# EAGLE design tiny fox predatronics (EAGLE 9.5.2)
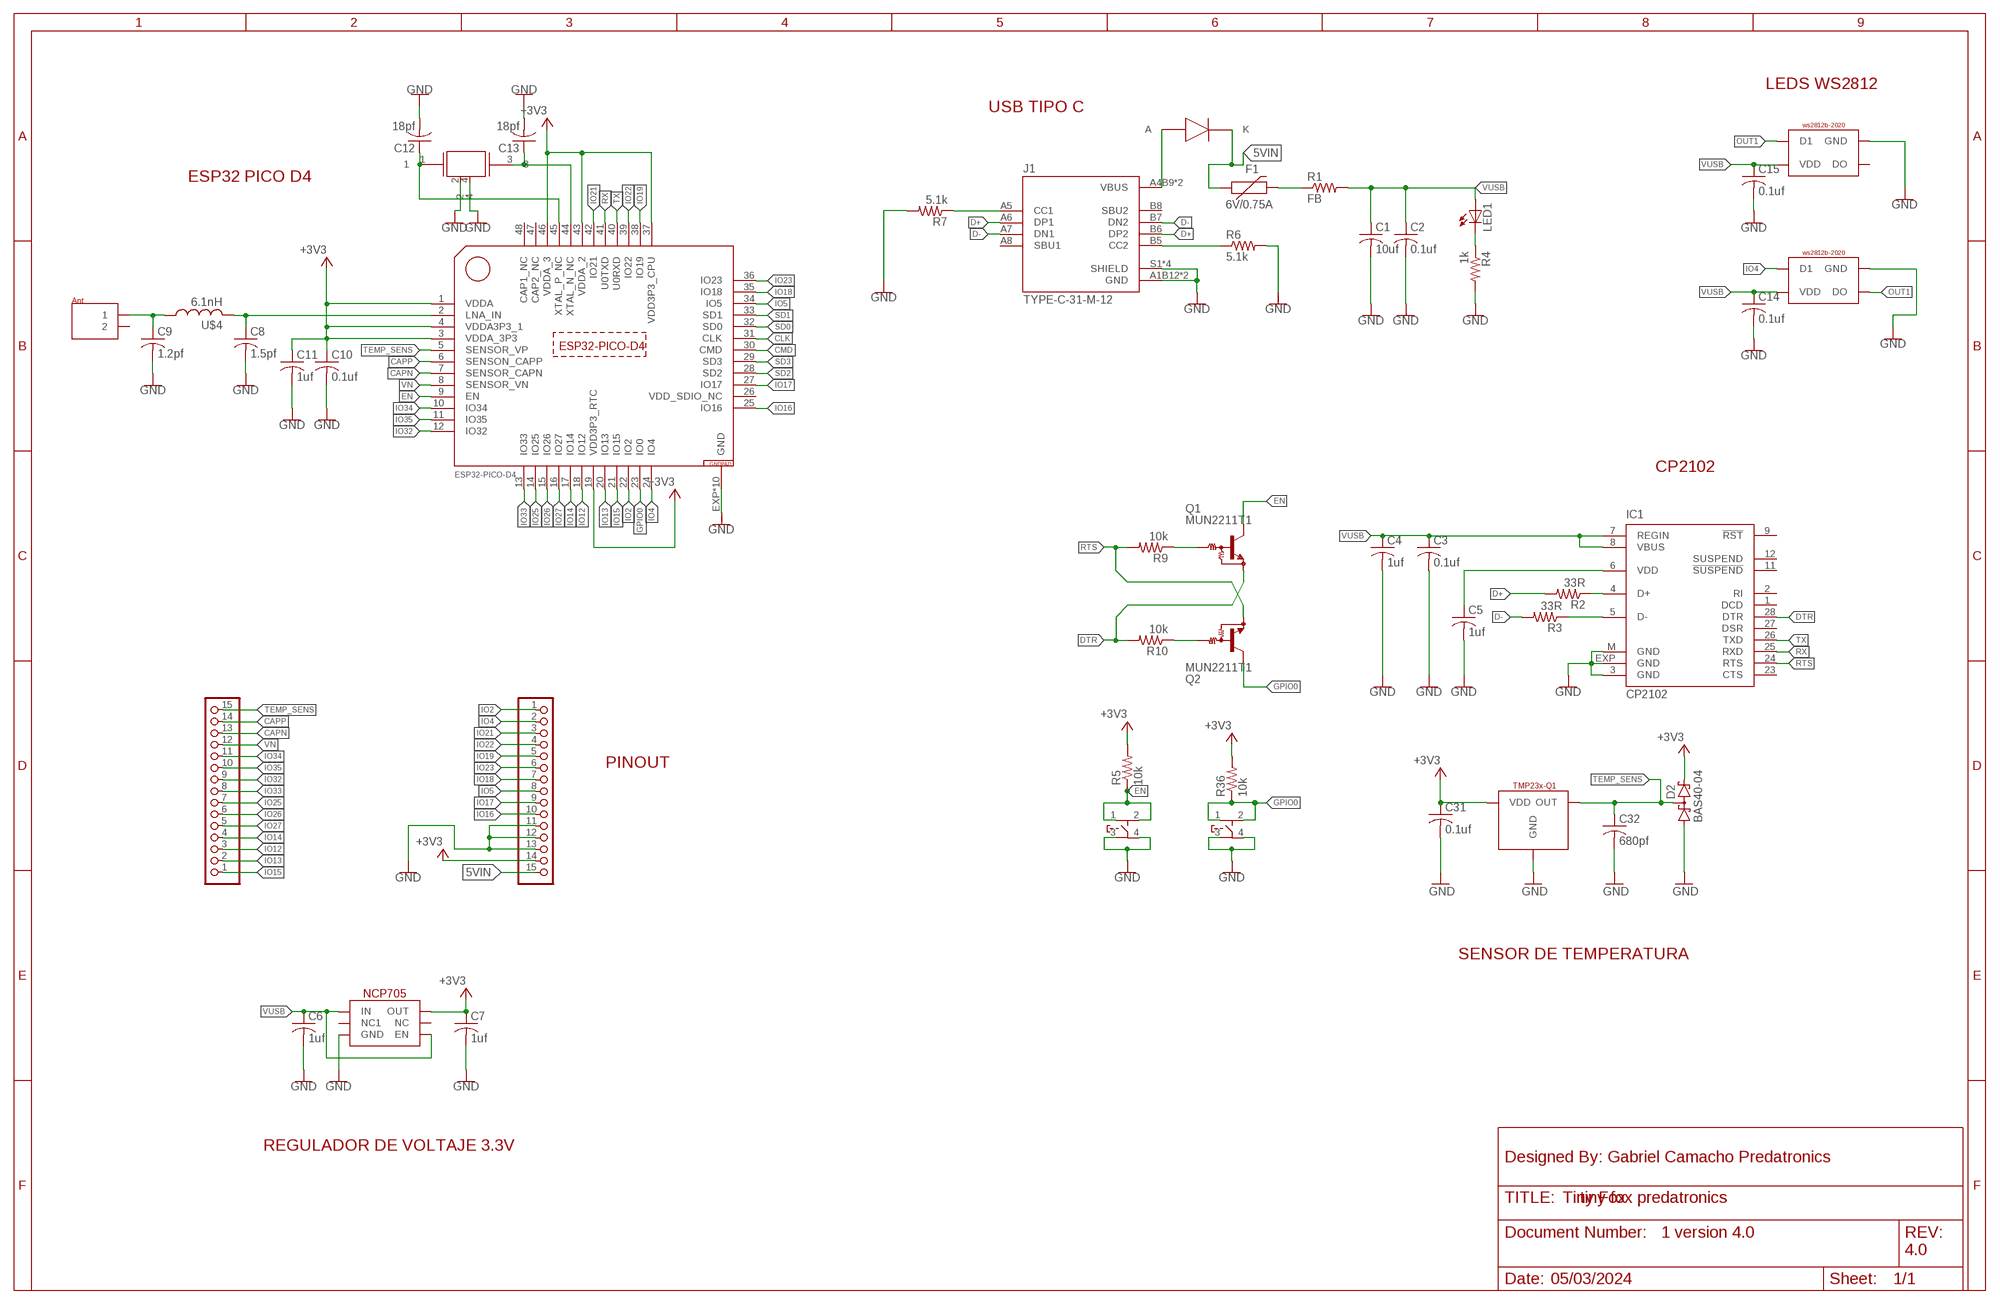
[diagram p0: schematic, sheet 1]

## Parts
C1  10uf  C-USC0805  [C0805]
C2  0.1uf  C-USC0603  [C0603]
C3  0.1uf  C-USC0603  [C0603]
C4  1uf  C-USC0603  [C0603]
C5  1uf  C-USC0603  [C0603]
C6  1uf  C-USC0603  [C0603]
C7  1uf  C-USC0603  [C0603]
C8  1.5pf  C-USC0402  [C0402]
C9  1.2pf  C-USC0402  [C0402]
C10  0.1uf  C-USC0603  [C0603]
C11  1uf  C-USC0603  [C0603]
C12  18pf  C-USC0603  [C0603]
C13  18pf  C-USC0603  [C0603]
C14  0.1uf  C-USC0603  [C0603]
C15  0.1uf  C-USC0603  [C0603]
C31  0.1uf  C-USC0603  [C0603]
C32  680pf  C-USC0603  [C0603]
D2  BAS40-04  [SOT23]
F1  6V/0.75A  PPTC_THREE-QUARTER-AMP  [1206]
IC1  CP2102  [MLP28]
J1  TYPE-C-31-M-12  [HRO_TYPE-C-31-M-12]
JP1  PINHD-1X15  [1X15]
JP2  PINHD-1X15  [1X15]
LED1  LEDCHIPLED_0603  [CHIPLED_0603]
Q1  MUN2211T1  [SC59-BEC]
Q2  MUN2211T1  [SC59-BEC]
R1  FB  R-US_R0805  [R0805]
R2  33R  R-US_R0603  [R0603]
R3  33R  R-US_R0603  [R0603]
R4  1k  R-US_R0603  [R0603]
R5  10k  R-US_R0603  [R0603]
R6  5.1k  R-US_R0402  [R0402]
R7  5.1k  R-US_R0402  [R0402]
R9  10k  R-US_R0603  [R0603]
R10  10k  R-US_R0603  [R0603]
R36  10k  R-US_R0603  [R0603]
U$1  ESP32-PICO-D4  [QFN48]
U$2  WS2812B-2020  [2020]
U$3  NCP705  [WDFN6]
U$4  6.1nH  INDUCTOR_0402_M  [RESC0402_M]
U$5  CHIP-ANTHENA  [ANTHENFOOT]
U$6  ECX-32  [EXC-32]
U$7  WS2812B-2020  [2020]
U$10  RB160MM-50TF  [SOD-123FL]
U$21  TMP23X-Q1  [SOT-23]
U$22  XUNPU  [TS-1089S]
U$23  XUNPU  [TS-1089S]

## Nets
5VIN: F1.1 JP2.15 U$10.K
+3V3: C7.1 C10.1 C11.1 C31.1 D2.2(C2) JP2.14 R5.2 R36.2 U$1.1(VDDA) U$1.3(VDDA_3P3) U$1.4(VDDA3P3_1) U$1.19(VDD3P3_RTC) U$1.37(VDD3P3_CPU) U$1.43(VDDA_2) U$1.46(VDDA_3) U$3.OUT U$21.VDD
CAPN: JP1.13 U$1.7(SENSOR_CAPN)
CAPP: JP1.14 U$1.6(SENSON_CAPP)
CLK: U$1.31(CLK)
CMD: U$1.30(CMD)
D+: J1.A6(DP1) J1.B6(DP2) R2.2
D-: J1.A7(DN1) J1.B7(DN2) R3.2
DTR: IC1.28(DTR) Q1.E R10.2
EN: Q1.C R5.1 U$1.9(EN) U$22.1 U$22.2
GND: C1.2 C2.2 C3.2 C4.2 C5.2 C6.2 C7.2 C8.2 C9.2 C10.2 C11.2 C12.2 C13.2 C14.2 C15.2 C31.2 C32.2 D2.1(A1) IC1.3(GND) IC1.EXP(GND) IC1.M(GND) J1.A1B12(GND) J1.B1A12(GND) J1.S1(SHIELD) J1.S2(SHIELD) J1.S3(SHIELD) J1.S4(SHIELD) JP2.11 JP2.12 JP2.13 R4.2 R6.2 R7.2 U$1.EXP(GND) U$1.P$1(GND) U$1.P$2(GND) U$1.P$3(GND) U$1.P$4(GND) U$1.P$5(GND) U$1.P$6(GND) U$1.P$7(GND) U$1.P$8(GND) U$1.P$9(GND) U$2.GND U$3.GND U$3.P$7(GND) U$3.P$8(GND) U$6.2 U$6.4 U$7.GND U$21.GND U$22.3 U$22.4 U$23.3 U$23.4
GPIO0: Q2.C R36.1 U$1.23(IO0) U$23.1 U$23.2
IO2: JP2.1 U$1.22(IO2)
IO4: JP2.2 U$1.24(IO4) U$2.D1
IO5: JP2.8 U$1.34(IO5)
IO12: JP1.3 U$1.18(IO12)
IO13: JP1.2 U$1.20(IO13)
IO14: JP1.4 U$1.17(IO14)
IO15: JP1.1 U$1.21(IO15)
IO16: JP2.10 U$1.25(IO16)
IO17: JP2.9 U$1.27(IO17)
IO18: JP2.7 U$1.35(IO18)
IO19: JP2.5 U$1.38(IO19)
IO21: JP2.3 U$1.42(IO21)
IO22: JP2.4 U$1.39(IO22)
IO23: JP2.6 U$1.36(IO23)
IO25: JP1.7 U$1.14(IO25)
IO26: JP1.6 U$1.15(IO26)
IO27: JP1.5 U$1.16(IO27)
IO32: JP1.9 U$1.12(IO32)
IO33: JP1.8 U$1.13(IO33)
IO34: JP1.11 U$1.10(IO34)
IO35: JP1.10 U$1.11(IO35)
N$1: J1.A4B9(VBUS) J1.B4A9(VBUS) U$10.A
N$2: J1.B5(CC2) R6.1
N$3: IC1.4(D+) R2.1
N$4: IC1.5(D-) R3.1
N$5: C5.1 IC1.6(VDD)
N$6: LED1.C R4.1
N$7: C9.1 U$4.1 U$5.1
N$8: C8.1 U$1.2(LNA_IN) U$4.2
N$9: C13.1 U$1.44(XTAL_N_NC) U$6.3
N$10: Q1.B R9.1
N$11: Q2.B R10.1
N$12: C12.1 U$1.45(XTAL_P_NC) U$6.1
N$13: J1.A5(CC1) R7.1
N$14: F1.2 R1.1
OUT1: U$2.DO U$7.D1
RTS: IC1.24(RTS) Q2.E R9.2
RX: IC1.25(RXD) U$1.41(U0TXD)
SD0: U$1.32(SD0)
SD1: U$1.33(SD1)
SD2: U$1.28(SD2)
SD3: U$1.29(SD3)
TEMP_SENS: C32.1 D2.3(C1A2) JP1.15 U$1.5(SENSOR_VP) U$21.VOUT(OUT)
TX: IC1.26(TXD) U$1.40(U0RXD)
VN: JP1.12 U$1.8(SENSOR_VN)
VUSB: C1.1 C2.1 C3.1 C4.1 C6.1 C14.1 C15.1 IC1.7(REGIN) IC1.8(VBUS) LED1.A R1.2 U$2.VDD U$3.EN U$3.IN U$7.VDD
Unconnected: IC1.1(DCD) IC1.2(RI) IC1.9(!RST) IC1.11(!SUSPEND) IC1.12(SUSPEND) IC1.23(CTS) IC1.27(DSR) J1.A8(SBU1) J1.B8(SBU2) U$1.47(CAP2_NC) U$1.48(CAP1_NC) U$3.NC U$3.NC1 U$5.2 U$7.DO

## Notes on the sheet
- LEDS WS2812
- USB TIPO C
- ESP32 PICO D4
- CP2102
- PINOUT
- SENSOR DE TEMPERATURA
- REGULADOR DE VOLTAJE 3.3V
- Designed By: Gabriel Camacho Predatronics
- Tiny Fox
- 1 version 4.0
- 4.0
- 05/03/2024

## Power pins joined to a net without a drawn wire
VDD_SDIO_NC: U$1.26(VDD_SDIO_NC)

## Library data of the parts
C1-C15 C31 C32 = rcl:C-US: CAPACITOR, American symbol; SPICEPREFIX: C
D2 = diode:BAS40-04: Silicon Schottky Diodes General-purpose diode for high-speed switching
F1 = SparkFun-Fuses:PPTC: Resettable Fuse PPTC Resettable Fuse. Really a sort of resistor with a polymeric positive temperature coefficient whose resistance increases dramatically with an increase in temperature. When heated by the power passing through the resistance rises causing the current to be limited, protecting the circuit. This is achieved by the transition of the polymer from a crystalline to an amorphous state where the conductive carbon separates breaking the conductive pathways found in the cool crystalline structure. When a PPTC cools back down it resumes conducting letting the circuit turn back on. SparkFun Products: SparkFun RedBoard - Programmed with Arduino <https://www.sparkfun.com/products/12757> Pro Micro - 5V/16MHz <https://www.sparkfun.com/products/12640> Arduino Pro 328 - 5V/16MHz <https://www.sparkfun.com/products/10915> MP3 Trigger <https://www.sparkfun.com/products/13720>; PROD_ID: RES-11150
IC1 = silabs:CP210*: Single-Chip USB to UART Bridge Source: www.silabs.com .. CP2101.pdf / cp2102.pdf; MF: FARNELL; MPN: CP2102-GM; OC_FARNELL: 9282130; OC_NEWARK: 30K5635
J1 = TYPE-C-31-M-12:TYPE-C-31-M-12: USB Connectors 24 Receptacle 1 8.94*7.3mm RoHS Check availability <https://pricing.snapeda.com/parts/TYPE-C-31-M-12/HRO%20Electronics%20Co.%2C%20Ltd./view-part?ref=eda>; AVAILABILITY: Not in stock; DESCRIPTION: USB Connectors 24 Receptacle 1 8.94*7.3mm RoHS; MF: HRO Electronics Co., Ltd.; MP: TYPE-C-31-M-12; PACKAGE: Package; PRICE: None
JP1 JP2 = pinhead:PINHD-1X15: PIN HEADER
LED1 = adafruit:LED: LED OSRAM: - CHIPLED LG R971, LG N971, LY N971, LG Q971, LY Q971, LO R971, LY R971 LH N974, LH R974 LS Q976, LO Q976, LY Q976 LO Q996 - Hyper CHIPLED LW Q18S LB Q993, LB Q99A, LB R99A - SideLED LS A670, LO A670, LY A670, LG A670, LP A670 LB A673, LV A673, LT A673, LW A673 LH A674 LY A675 LS A676, LA A676, LO A676, LY A676, LW A676 LS A679, LY A679, LG A679 - Hyper Micro SIDELED® LS Y876, LA Y876, LO Y876, LY Y876 LT Y87S - SmartLED LW L88C, LW L88S LB L89C, LB L89S, LG L890 LS L89K, LO L89K, LY L89K LS L896, LA L896, LO L896, LY L896 - TOPLED LS T670, LO T670, LY T670, LG T670, LP T670 LSG T670, LSP T670, LSY T670, LOP T670, LYG T670 LG T671, LOG T671, LSG T671 LB T673, LV T673, LT T673, LW T673 LH T674 LS T676, LA T676, LO T676, LY T676, LB T676, LH T676, LSB T676, LW T676 LB T67C, LV T67C, LT T67C, LS T67K, LO T67K, LY T67K, LW E67C LS E67B, LA E67B, LO E67B, LY E67B, LB E67C, LV E67C, LT E67C LW T67C LS T679, LY T679, LG T679 LS T770, LO T770, LY T770, LG T770, LP T770 LB T773, LV T773, LT T773, LW T773 LH T774 LS E675, LA E675, LY E675, LS T675 LS T776, LA T776, LO T776, LY T776, LB T776 LHGB T686 LT T68C, LB T68C - Hyper Mini TOPLED® LB M676 - Mini TOPLED Santana® LG M470 LS M47K, LO M47K, LY M47K Source: http://www.osram.convergy.de/
Q1 Q2 = transistor-npn:MUN2211*: NPN Bias Resistor Transistor
R1 = audio amplifier example:R-US_: RESISTOR, American symbol
R2-R4 R9 R10 = resistor:R-US_: RESISTOR, American symbol
R5 R36 = adafruit:R-US_: RESISTOR, American symbol
R6 R7 = rcl:R-US_: RESISTOR, American symbol; SPICEPREFIX: R
U$1 = esp32-pico-d4:ESP32-PICO-D4
U$2 U$7 = ws2812b-2020:WS2812B-2020
U$3 = NCP705:NCP705
U$4 = Nordic_nRF:INDUCTOR: Generic chip inductor
U$5 = NN01-110:CHIP-ANTHENA
U$6 = cristal:ECX-32
U$10 = RB160MM-50TF:RB160MM-50TF
U$21 = TMP23x-Q1:TMP23X-Q1
U$22 U$23 = TS-1089S-02526:XUNPU

## Board
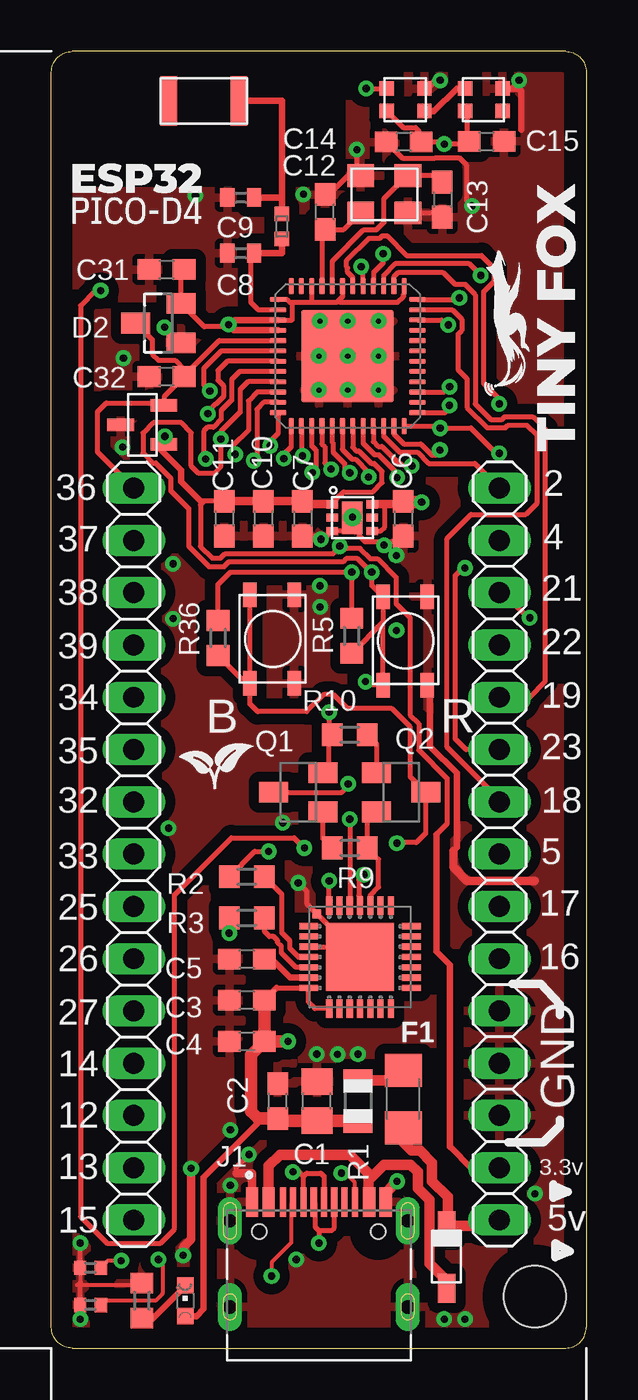
[diagram p1: board, top side]
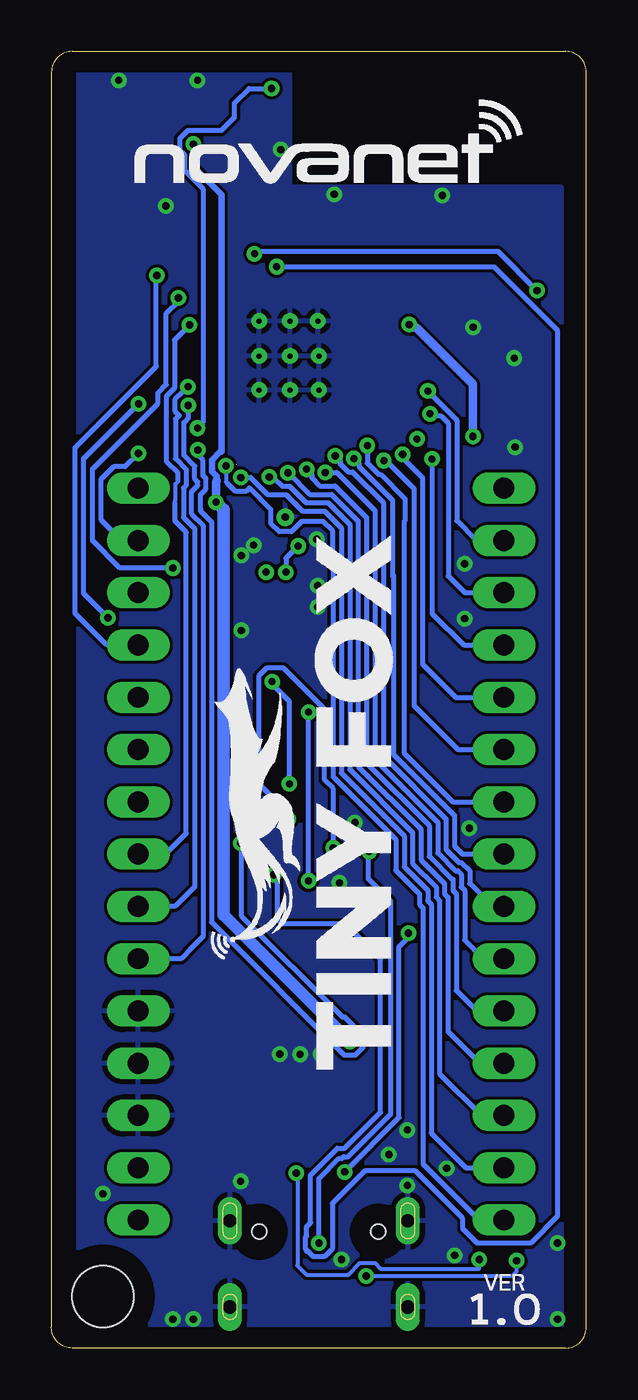
[diagram p2: board, bottom side, seen from below]

Size 26 x 63 mm. Coordinates in mm from the lower left corner, seen from the top.
Outline: 1,0 25,0 arc90 26,1 26,62 arc90 25,63 1,63 arc90 0,62 0,1 arc90 1,0
Copper layers (1*16): Top 0.035mm / dielectric 1.5mm / Bottom 0.035mm
Design rules "default *": minimum track width 6mil, minimum drill 0.35mm, track to track 6mil, track to pad 6mil, pad to pad 6mil, via to via 6mil, smd to smd 6mil, copper to edge 40mil, drill to drill 6mil, minimum pad ring 10mil, minimum via ring 8mil, stop-mask expansion 4mil, vias tented up to drill 14mil, thermal gap 10mil
Holes 3 mm at 23.5,2.5

### Footprints (pad centres in the part's own frame; a part is rotated, then mirrored left to right if it is on the bottom)
C0805 = smd 1.3 x 1.5: 1 -0.95,0; 2 0.95,0
C0603 = smd 1.1 x 1: 1 -0.85,0; 2 0.85,0
C0402 = smd 0.7 x 0.9: 1 -0.65,0; 2 0.65,0
SOT23 = smd 1 x 1.4: 1 -0.95,-1.1; 2 0.95,-1.1; 3 0,1.1
1206 = smd 1.6 x 1.8: 1 -1.4,0; 2 1.4,0
MLP28 = smd 0.9 x 0.3: 1 -2.5,1.5; 2 -2.5,1; 3 -2.5,0.5; 4 -2.5,0; 5 -2.5,-0.5; 6 -2.5,-1; 7 -2.5,-1.5; 15 2.5,-1.5; 16 2.5,-1; 17 2.5,-0.5; 18 2.5,0; 19 2.5,0.5; 20 2.5,1; 21 2.5,1.5 | smd 0.3 x 0.9: 8 -1.5,-2.5; 9 -1,-2.5; 10 -0.5,-2.5; 11 0,-2.5; 12 0.5,-2.5; 13 1,-2.5; 14 1.5,-2.5; 22 1.5,2.5; 23 1,2.5; 24 0.5,2.5; 25 0,2.5; 26 -0.5,2.5; 27 -1,2.5; 28 -1.5,2.5 | smd 3.3 x 3.3: EXP 0,0 | smd 0.435 x 0.435: M -2.103,2.103
HRO_TYPE-C-31-M-12 = smd 0.6 x 1.45: A1B12 -3.25,5.095; A4B9 -2.45,5.095; B1A12 3.25,5.095; B4A9 2.45,5.095 | smd 0.3 x 1.45: A5 -1.25,5.095; A6 -0.25,5.095; A7 0.25,5.095; A8 1.25,5.095; B5 1.75,5.095; B6 0.75,5.095; B7 -0.75,5.095; B8 -1.75,5.095 | drill 0.65 pad 1.05 long: S1 -4.32,4.18; S2 4.32,4.18; S3 -4.32,0; S4 4.32,0 | hole 0.7: -2.89,3.65; 2.89,3.65
1X15 = drill 1.016 long: 1 -17.78,0; 2 -15.24,0; 3 -12.7,0; 4 -10.16,0; 5 -7.62,0; 6 -5.08,0; 7 -2.54,0; 8 0,0; 9 2.54,0; 10 5.08,0; 11 7.62,0; 12 10.16,0; 13 12.7,0; 14 15.24,0; 15 17.78,0
CHIPLED_0603 = smd 0.8 x 0.8: A 0,-0.75; C 0,0.75
SC59-BEC = smd 1 x 1.4: B -0.95,-1.2; C 0,1.2; E 0.95,-1.2
R0805 = smd 1.1 x 1.4: 1 -1,0; 2 1,0
R0603 = smd 1 x 1.1: 1 -0.85,0; 2 0.85,0
R0402 = smd 0.6 x 0.7: 1 -0.5,0; 2 0.5,0
QFN48 = smd 0.8 x 0.25: 1 -3.395,2.75; 2 -3.395,2.25; 3 -3.395,1.75; 4 -3.395,1.25; 5 -3.385,0.75; 6 -3.395,0.25; 7 -3.395,-0.25; 8 -3.395,-0.75; 9 -3.395,-1.25; 10 -3.395,-1.75; 11 -3.395,-2.25; 12 -3.395,-2.75; 25 3.395,-2.75; 26 3.395,-2.25; 27 3.395,-1.75; 28 3.395,-1.25; 29 3.395,-0.75; 30 3.395,-0.25; 31 3.395,0.25; 32 3.395,0.75; 33 3.395,1.25; 34 3.395,1.75; 35 3.395,2.25; 36 3.395,2.75 | smd 0.25 x 0.8: 13 -2.75,-3.395; 14 -2.25,-3.395; 15 -1.75,-3.395; 16 -1.25,-3.395; 17 -0.75,-3.395; 18 -0.25,-3.395; 19 0.25,-3.395; 20 0.75,-3.395; 21 1.25,-3.395; 22 1.75,-3.395; 23 2.25,-3.395; 24 2.75,-3.395; 37 2.75,3.395; 38 2.25,3.395; 39 1.75,3.395; 40 1.25,3.395; 41 0.75,3.395; 42 0.25,3.395; 43 -0.25,3.395; 44 -0.75,3.395; 45 -1.25,3.395; 46 -1.75,3.395; 47 -2.25,3.395; 48 -2.75,3.395 | smd 4.5 x 4.5: EXP 0,0 | drill 0.25 pad 0.406: P$1 0,0; P$2 -1.4,0; P$3 -1.4,-1.65; P$4 -1.35,1.7; P$5 1.5,1.7; P$6 1.5,0; P$7 0,1.7; P$8 0,-1.65; P$9 1.5,-1.65
2020 = smd 0.7 x 0.7: D1 0,1.1; DO 1.83,0; GND 1.83,1.1; VDD 0,0
WDFN6 = smd 0.55 x 0.4: EN 1.9,0; GND -0.05,0; IN 1.9,1.3; NC -0.05,0.65; NC1 1.9,0.65; OUT -0.05,1.3 | smd 1 x 1.6: P$7 0.92,0.64 | drill 0.35 pad 0.61: P$8 0.93,0.67
RESC0402_M = smd 0.7 x 0.7: 1 -0.6,0; 2 0.6,0
ANTHENFOOT = smd 0.8 x 2.4: 1 3.4,0; 2 0,0
EXC-32 = smd 1.3 x 1.1: 1 0,0; 2 2.3,0; 3 2.3,1.8; 4 0,1.8
SOD-123FL = smd 0.85 x 1.4: A 0,0; K 0,3.05
SOT-23 = smd 1.3 x 0.6: GND 2.1,0.95; VDD 0,1.9; VOUT 0,0
TS-1089S = smd 1.2 x 0.65: 1 0,2.15; 2 4.3,2.15; 3 0,0; 4 4.3,0

### Placement (x,y rotation side)
C1  12.9,12 90 top
C2  11,12 90 top
C3  9.5,16.9 180 top
C4  9.5,14.9 180 top
C5  9.5,18.9 180 top
C6  17.1,40.3 270 top
C7  12.2,40.3 270 top
C8  9.2,53.2 180 top
C9  9.2,55.9 180 top
C10  10.3,40.3 270 top
C11  8.4,40.3 270 top
C12  13.3,55.2 90 top
C13  19,55.8 270 top
C14  17.13,58.6 180 top
C15  21.15,58.63 0 top
C31  5.6,52.4 180 top
C32  5.6,47.2 180 top
D2  5.2,49.8 90 top
F1  17.1,12.1 90 top
IC1  15,19 0 top
J1  13,2 0 top
JP1  4,24 90 top
JP2  21.78,24 270 top
LED1  6.5,2.3 0 top
Q1  12,27 90 top
Q2  17,27 270 top
R1  14.9,12 270 top
R2  9.5,22.9 180 top
R3  9.5,20.9 180 top
R4  4.4,2.3 90 top
R5  14.6,34.6 90 top
R6  1.9,2.1 180 top
R7  1.9,3.9 180 top
R9  14.5,24.3 0 top
R10  14.5,29.8 180 top
R36  8.1,34.5 90 top
U$1  14.4,48.2 0 top
U$2  16.3,60.1 0 top
U$3  13.7,39.7 0 top
U$4  11.2,54.5 270 top
U$5  5.7,60.6 0 top
U$6  15.03,55.16 0 top
U$7  20.1,60.1 0 top
U$10  19.2,2.9 0 top
U$21  5.47,45.81 180 top
U$22  18.27,32.21 90 top
U$23  11.8,32.3 90 top

### Tracks (layer width: path | path; a pad name or v marks a point on that pad's centre or on a via)
5VIN
  Top 0.508: F1.1 17.1,10 17.5,9.6 17.9,9.6 18.5,9 18.5,8.11 19.27,7.34 19.27,6.02 U$10.K 21.51,5.95 JP2.15
+3V3  (via drill 0.35)
  Top 0.254: 12.65,51.55 U$1.46 12.65,50.88 12.67,50.86 | v8.61,49.73 8.5,49.62 7.43,49.62 D2.2 6.3,52.25 C31.1 | U$21.VDD 5.97,43.91 | 7.25,41.15 C11.1 7.42,41.15 7.25,40.98 7.25,38.96 7.83,38.38 8.22,38.38 8.44,38.6 13.7,38.6 14.01,38.91 v14.01,38.97 14.13,38.85 15.01,38.85 15.5,38.36 15.84,38.36 16.75,37.44 16.75,36.17 17.43,35.49 17.43,30.77 17.86,30.34 17.86,29.05 19.23,27.68 19.23,25.47 18.72,24.96 | 11.1,49.95 U$1.3 11.7,49.95 11.7,50.73 11.61,50.82 | R36.2 8.1,37.1 8.7,37.7 14.4,37.7 14.6,37.5 | R5.2 14.6,37.5 | 14.6,37.5 v14.6,37.7 | U$1.1 11.03,50.93 11.47,50.93 11.58,50.82 11.61,50.82 | 11.61,50.82 12.63,50.82 12.67,50.86 | 12.67,50.86 12.71,50.82 13.88,50.82 13.95,50.89 | 13.95,50.89 14.15,51.09 U$1.43 | 13.95,50.89 14.03,50.81 16.83,50.81 17.12,51.1 17.12,51.2 17.15,51.23 U$1.37 | 13.65,41.05 U$3.OUT 13.84,41.19 13.84,41.26 14,41.42 14.02,41.42 14.2,41.6 15.62,41.6 16.07,42.05 16.07,42.6 15.69,42.98 15.56,42.98 14.95,43.59 14.81,43.59 14.65,43.76 U$1.19 | 19.48,9.75 19.41,9.75
  Top 0.305: U$1.3 8.9,49.95 8.68,49.73 v8.61,49.73 8.6,49.72 8.86,49.45 U$1.4 | 7.25,41.15 6.3,42.1 6.3,42.65 5.26,43.7 U$21.VDD 5.47,44.26 v5.51,44.3 | JP2.14 20.4,8.76 19.41,9.75 19.38,9.78 19.38,18.62 18.72,19.28 18.72,24.96
  Top 0.406: U$3.OUT 12.35,41 C7.1 | C7.1 C10.1 C11.1 | C7.1 12.13,41.08 12.13,41.05
  Bottom 0.254: v14.01,38.97 14.6,38.38 v14.6,37.7
  Bottom 0.406: v5.51,44.3 5.51,46.83 8.27,49.59 8.5,49.59 8.61,49.7 v8.61,49.73
CAPN  (via drill 0.35)
  Top 0.254: U$1.7 8.55,47.95 8.1,47.5 8.1,47.03 8.36,46.77 8.36,46.23 7.97,45.84 7.94,45.84 7.7,45.6 7.7,45.4 v7.6,45.4
  Bottom 0.254: v7.6,45.4 7.5,45.3 7.08,45.3 6.71,44.93 6.71,37.51 5.9,36.7 JP1.13
CAPP  (via drill 0.35)
  Top 0.254: U$1.6 8.25,48.45 7.4,47.6 7.4,46.8 v7.7,46.5
  Bottom 0.254: v7.7,46.5 6.3,45.1 6.3,40.2 5.34,39.24 JP1.14
D+  (via drill 0.35)
  Top 0.254: 13,5.7 13.6,5.7 13.75,5.85 J1.B6 | J1.A6 12.82,7.02 12.82,5.88 13,5.7 | 13,5.7 v13,5.1 | R2.2 9.88,24.13 v10.56,24.13
  Bottom 0.254: v13,5.1 13,8.23 12.01,9.22 11.88,9.22 11.8,9.3 11.58,9.3 9.51,11.37 9.51,21.71 10.6,22.8 10.6,24.09 v10.56,24.13
D-  (via drill 0.35)
  Top 0.254: 12.25,8.35 12.4,8.5 13.1,8.5 13.25,8.35 J1.A7 | J1.B7 12.25,8.35 | 12.25,8.35 12,8.6 11.78,8.6 v11.74,8.56 | R3.2 v8.64,20.16
  Bottom 0.254: v11.74,8.56 9.1,11.2 9.1,19.5 8.64,19.96 v8.64,20.16
DTR  (via drill 0.35)
  Top 0.254: v13.5,30.9 13.5,29.8 | R10.2 13.5,29.8 | IC1.28 v13.5,22.7 | Q1.E 13.5,28.25 13.5,29.8
  Bottom 0.254: v13.5,22.7 v13.5,30.9
EN  (via drill 0.35)
  Top 0.254: U$1.9 9.55,46.95 9.17,46.57 9.17,45.47 8.23,44.53 v8.23,44.17 8.23,42.83 7.9,42.5 7.16,42.5 6.8,42.86 6.8,44.48 6.32,44.96 4.95,44.96 4.45,44.46 4.45,43.48 4.93,43 5.07,43 5.8,42.27 5.8,41.66 6.67,40.79 6.67,38.96 7.66,37.97 8.39,37.97 8.62,38.2 | v15.56,37.7 15.56,37.07 U$22.2 16.12,35.27 16.1,35.25 | 16.1,35.25 R5.1 | 16.1,35.25 16.1,32.23 U$22.1 15.44,32.21 v15.27,32.38 | Q1.C 14.12,27 14.45,27.33 14.45,27.39 v14.43,27.41 | v15.56,37.7 v15.57,37.7 | v15.56,37.7 15.53,37.7 14.87,38.36 14.33,38.36 14.17,38.2 8.62,38.2 | 8.49,38.08 8.61,38.2 8.62,38.2
  Bottom 0.254: 15.6,37.73 v15.56,37.7 15.46,37.6 | v8.23,44.17 8.35,44.29 | v14.43,27.41 14.43,31.42 15.27,32.26 v15.27,32.38
GND  (via drill 0.35)
  Top 0.203: R4.2 4.3,3.05 1.25,3.05 1.4,3.2 R7.2
  Top 0.254: IC1.EXP 14.05,19.95 | 14.05,19.95 IC1.M 12.4,21.6 12.4,22.2 v12,22.6 | C12.2 13.5,56.05 14.85,57.4 v14.85,58.23 | D2.1 6.25,48.85 v5.5,49.6 | IC1.3 13.8,19.5 14.05,19.75 14.05,19.95 | U$3.P$7 14.4,40.12 14.4,39.8 14.3,39.7 U$3.GND 13.4,39.45 C7.2 12.95,39.45 v13.1,39.3 | v22.73,61.6 22.33,61.2 U$7.GND | C6.2 16.82,39.17 15.26,39.17 14.96,39.47 14.96,39.82 | U$6.2 18.79,55.16 C13.2 | U$22.3 18.4,32.08 | C14.2 17.06,57.82 18.65,57.82 18.66,57.84 19.82,57.84 20.19,57.47 20.19,55.74 v20.44,55.49 | 9,8.5 9,8.8 v9.6,9.4 | R7.2 v1.4,5.1 | 1.4,3.2 v1.4,1.4 R6.2
  Top 0.305: U$7.GND 22.7,61.2 22.83,61.07 22.83,59.2 | U$2.GND 18.27,61.2 18.67,61.6 v18.9,61.6 | 19.53,24.15 19.7,24.32 19.7,27.93 18.4,29.23 18.4,32.08 | U$3.P$8 U$3.P$7 14.62,40.16 14.96,39.82
  Top 0.406: J1.A1B12 9.75,8.5 9,8.5 | v6.4,4.5 6.4,4.9 6.79,5.29 v6.79,8.73 | 19.53,24.15 19.53,23.37 20.2,22.7 23.5,22.7
  Top 0.508: J1.B1A12 16.25,7.55 v16.8,8.1
  other vias: 7,56 3.5,48.1 5.91,35.44 13.05,37.04 3.46,43.77 16.77,34.87 11.25,25.53 5.91,38.11 12.9,14.28 13.91,14.27 5.69,25.26 13.06,36.01 16.77,38.51 14.9,14.28 16.17,39.01 19.1,1.4 20.1,1.4 23.5,7.5 8.7,7.9 8.7,10.6 11.9,4.3 12.25,56.06
  pour Top (isolate 0.5): 1.2,0.2 24.7,0.2 24.7,62.8 14.5,62.8 14.5,56.2 1.2,56.2
  pour Bottom: 1.2,56.4 14.4,56.4 14.4,62.8 24.7,62.8 24.7,0.2 1.2,0.2
GPIO0  (via drill 0.35)
  Top 0.254: R36.1 9.45,32.3 U$23.1 | U$23.1 U$23.2 | U$1.23 16.64,44.41 17.13,43.93 17.96,43.93 18.5,43.39 18.68,43.39 18.88,43.59 v18.88,43.64 | v16.79,24.53 16.82,24.55 17.73,24.55 18.2,25.02 Q2.C 17.45,27.75 17.45,30.17 16.55,31.07 14.38,31.07 13.7,31.75 13.24,31.75 12.41,30.92 10.02,30.92 9.65,31.29 U$23.1
  Bottom 0.254: v16.79,24.53 16.91,24.64 16.75,24.8 16.75,20.98 11.85,16.08 11.75,16.08 10.84,15.17 10.84,14.63 11.23,14.24 11.77,14.24 18.22,20.69 18.22,40.14 18.76,40.68 18.76,40.78 | 18.77,40.79 18.76,40.78 | 18.88,43.36 18.88,43.39 | 18.88,43.39 v18.88,43.64 | 18.76,40.78 18.76,41.47 18.48,41.75 18.48,42.26 18.63,42.4 18.63,43.14 18.88,43.39
IO2
  Top 0.203: U$1.22 16.15,44.38
  Top 0.254: JP2.1 20.58,42.98 18.33,42.98 17.79,43.52 16.92,43.52 16.15,44.3 U$1.22
IO4  (via drill 0.35)
  Top 0.254: v15.3,61.2 U$2.D1 | U$1.24 18.79,44.8 v18.9,44.7 20.4,44.7 21.63,43.47 v21.77,43.47
  Bottom 0.254: v15.3,61.2 16.4,61.2 17.1,60.5 17.1,59.8 17.74,59.16 19.37,59.16 19.76,58.77 19.76,58.23 19.53,58 19.53,57.22 18.63,56.32 18.63,44.97 v18.9,44.7 | v21.77,43.47 22.42,42.82 22.97,42.82 23.6,42.2 23.6,40.26 22.58,39.24 JP2.2
IO5  (via drill 0.35)
  Top 0.254: U$1.34 18.97,49.95 19.21,49.71 v19.29,49.71
  Bottom 0.2: 19.99,41.08 19.99,41.17 19.96,41.2 19.96,41.99 19.85,42.1
  Bottom 0.254: v19.29,49.71 20.02,48.98 20.02,46.64 20.41,46.24 20.41,43.09 19.85,42.53 19.85,42.1 | JP2.8 20.45,24 19.44,25.01 19.44,39.64 19.99,40.19 19.99,41.08
IO12  (via drill 0.35)
  Top 0.254: U$1.18 14.15,43.66 14.62,43.19 14.78,43.19 15.41,42.55 v15.41,42.32
  Bottom 0.254: v15.41,42.32 15.16,42.32 15.16,42.26 14.78,41.87 14.42,41.87 13.62,41.07 12.55,41.07 11.5,40.02 11.5,28.1 8.44,25.04 8.44,23.55 7.3,22.4 7.3,21.9 7.13,21.73 7.13,13.33 5.1,11.3 JP1.3
IO13  (via drill 0.35)
  Top 0.254: U$1.20 15.15,43.96 15.71,43.4 15.9,43.4 16.7,42.6 16.7,42.4 v16.8,42.3
  Bottom 0.254: v16.8,42.3 16.32,42.3 15.49,41.47 14.59,41.47 13.79,40.67 12.72,40.67 11.91,39.85 11.91,27.93 8.85,24.88 8.85,23.38 7.7,22.23 7.7,21.73 7.54,21.56 7.54,10.44 5.86,8.76 JP1.2
IO14  (via drill 0.35)
  Top 0.254: U$1.17 13.65,44.01 13.7,43.96 13.7,43.54 13.72,43.52 13.72,43.51 14.25,42.98 14.25,42.53 v14.5,42.53
  Bottom 0.254: v14.5,42.53 13.45,41.48 12.38,41.48 11.09,40.19 11.09,28.27 8.04,25.21 8.04,23.72 6.89,22.57 6.89,22.06 6.72,21.9 6.72,15.38 5.18,13.84 JP1.4
IO15  (via drill 0.35)  (1 unrouted)
  Top 0.203: 17,42.93 17.06,42.93 17.13,42.87 v17.52,42.87
  Top 0.254: U$1.21 15.65,44.04 15.88,43.81 16.07,43.81 16.92,42.96 17,42.96
  Bottom 0.203: v17.52,42.87 17.52,42.09 17.46,42.03
  Bottom 0.254: 17.46,42.03 17.07,41.64 16.53,41.64 16.38,41.79 15.34,40.74 15.34,40.08 14.92,39.66 14.34,39.66 13.83,40.17 12.79,40.17 12.31,39.69 12.31,37.86 12.32,37.85 12.32,35.11 12.31,35.1 12.31,27.76 9.26,24.71 9.26,23.21 8.11,22.06 8.11,21.56 7.94,21.39 7.94,8.94 5.22,6.22 JP1.1
IO16  (via drill 0.35)
  Top 0.254: U$1.25 19.12,45.45 19.41,45.74 v19.35,45.8
  Bottom 0.254: v19.35,45.8 19.35,45.18 19.56,44.97 19.56,43.38 19.04,42.86 19.04,42.24 18.89,42.09 18.89,41.92 19.18,41.62 19.18,40.53 18.63,39.98 18.63,19.99 19.16,19.45 | 19.16,19.45 19.17,19.45 19.39,19.23 | 19.16,19.45 19.7,18.92 JP2.10
IO17  (via drill 0.35)
  Top 0.254: U$1.27 19.07,46.45 19.08,46.46 19.1,46.46 v19.35,46.71 v19.36,46.71
  Bottom 0.254: v19.36,46.71 19.61,46.46 19.62,46.46 20.01,46.07 20.01,45.53 19.79,45.31 19.96,45.14 19.96,43.21 19.45,42.69 19.45,41.94 19.59,41.79 19.59,40.36 19.04,39.81 19.04,22.41 19.99,21.46 JP2.9
IO18
  Top 0.254: U$1.35 19.48,50.45 19.95,49.98 19.95,49.44 19.78,49.27 19.78,47.52 20.2,47.1 20.2,45.7 21.19,44.71 22.07,44.71 22.2,44.84 23.12,44.84 23.58,44.38 23.58,41.03 23.05,40.5 20.4,40.5 19.23,39.33 19.23,29.21 21.78,26.66 JP2.7
IO19
  Top 0.254: JP2.5 23.22,31.62 23.99,32.39 23.99,44.66 23.4,45.25 22.03,45.25 21.9,45.12 21.35,45.12 20.61,45.87 20.61,51.18 20.1,51.69 19.61,51.69 19.03,52.27 16.87,52.27 16.65,52.05 U$1.38
IO21  (via drill 0.35)
  Top 0.254: U$1.42 14.65,52.02 14.4,52.27 14.4,52.47 14.35,52.52 14.35,52.85 15.42,53.92 15.96,53.92 16.08,54.04 16.31,54.04 17.26,53.09 20.91,53.09 21.52,52.48 | JP2.3 21.97,36.7 23.19,35.48 v23.25,35.48 | v21.77,45.88 21.77,46.12 21.01,46.87 21.01,51.33 21.53,51.85 21.53,52.47 21.52,52.48 | 21.52,52.48 21.52,52.46
  Bottom 0.254: v23.25,35.48 24.43,36.66 24.43,43.23 21.88,45.78 21.86,45.78 v21.77,45.88
IO22  (via drill 0.35)
  Top 0.254: U$1.39 16.14,52.12 16.71,52.68 20.31,52.68 v20.87,52.12
  Bottom 0.254: JP2.4 23.31,34.16 24.85,35.7 24.85,43.74 20.9,47.69 20.9,52.09 v20.87,52.12
IO23  (via drill 0.35)
  Top 0.254: U$1.36 19.75,50.95 v19.83,51.03 | JP2.6 20.16,29.08 19.64,29.6 19.64,37.54 20,37.9 v20.1,37.9
  Bottom 0.254: v20.1,37.9 22.67,37.9 24,39.23 24,42.71 20.82,45.89 20.82,46.41 20.42,46.8 20.42,50.28 19.8,50.9 19.8,51 v19.83,51.03
IO25  (via drill 0.35)
  Top 0.254: U$1.14 12.15,43.35 v12.21,43.35
  Bottom 0.254: v12.21,43.35 11.96,43.1 11.96,42.95 11.57,42.57 11.36,42.57 9.87,41.07 9.87,28.77 6.82,25.72 6.82,24.22 6.19,23.59 6.06,23.59 5.67,23.2 5.67,22.57 4.56,21.46 JP1.7
IO26  (via drill 0.35)
  Top 0.254: U$1.15 12.65,43.84 12.87,43.62 12.87,42.68 12.73,42.54 v12.69,42.54
  Bottom 0.254: v12.69,42.54 12.12,42.54 10.28,40.7 10.28,40.68 10.28,28.61 7.22,25.55 7.22,24.05 6.36,23.19 6.23,23.19 6.08,23.03 6.08,22.4 5.91,22.23 5.91,19.81 5.02,18.92 JP1.6
IO27  (via drill 0.35)
  Top 0.254: U$1.16 13.15,43.93 13.29,43.79 13.29,43.01 v13.6,42.7
  Bottom 0.254: v13.6,42.7 13.34,42.45 13.34,42.27 12.96,41.89 12.22,41.89 10.69,40.36 10.69,28.44 7.63,25.38 7.63,23.88 6.53,22.78 6.48,22.78 6.48,22.23 6.32,22.07 6.32,17.37 5.33,16.38 JP1.5
IO32  (via drill 0.35)
  Top 0.254: U$1.12 11.01,44.43 10.55,43.97 10.55,43.94 v10.64,43.85
  Bottom 0.254: v10.64,43.85 10.64,42.99 10.11,42.47 10.02,42.47 8.81,41.25 8.81,40.22 8.86,40.17 8.86,28.91 6.49,26.54 JP1.9
IO33  (via drill 0.35)
  Top 0.254: U$1.13 11.65,43.78 11.28,43.41 11.28,43.24 v11.3,43.22
  Bottom 0.254: 9.37,37.54 9.37,28.84 6.41,25.88 6.41,24.39 6.02,24 JP1.8 | 9.37,37.54 | 9.37,37.54 9.41,37.5 9.41,41.19 11.05,42.83 11.05,42.97 v11.3,43.22
IO34  (via drill 0.35)
  Top 0.254: U$1.10 10.01,46.45 9.58,46.02 9.58,44.59 8.83,43.84 8.83,43.42 v8.93,43.42
  Bottom 0.254: v8.93,43.42 8.93,43.26 7.96,42.29 7.96,33.23 6.34,31.61 JP1.11
IO35  (via drill 0.35)
  Top 0.254: U$1.11 10.31,45.95 9.98,45.62 9.98,43.42 9.8,43.24 9.8,43.16 v9.84,43.12
  Bottom 0.254: v9.84,43.12 9.74,43.12 8.37,41.75 8.37,31.21 6.24,29.08 JP1.10
N$1
  Top 0.508: J1.A4B9 10.55,8.85 11.1,9.4 14.5,9.4 15.4,8.5 15.4,8.14 | 15.4,8.14 16.16,8.91 17.45,8.91 17.81,8.55 17.81,7.76 18.37,7.2 18.37,4.12 19.2,3.29 U$10.A | J1.B4A9 15.4,7.15 15.4,8.14
N$2  (via drill 0.35)
  Top 0.203: J1.B5 14.75,8.05 14.3,8.5 v14.1,8.5 | R6.1 2.6,2.3 5.06,2.3 5.4,2.64 5.4,4.1 v5.2,4.3
  Bottom 0.203: v14.1,8.5 14.04,8.44 14.04,4 13.6,3.56 11.57,3.56 11,4.13 10.28,4.13 10,3.86 5.2,3.86 v5.2,4.3
N$3
  Top 0.254: IC1.4 12.01,19 11.59,19.42 11.59,19.79 11.2,20.18 11.2,22.05 R2.1
N$4
  Top 0.254: 12.25,18.5 IC1.5 11.88,18.5 11.18,19.2 11.18,19.52 11,19.7 11,19.8 10.8,20 10.6,20 10.35,20.25 R3.1
N$5
  Top 0.305: IC1.6 11.6,18 10.7,18.9 C5.1
N$6
  Top 0.305: R4.1 4.95,1.45 6.5,3 LED1.C
N$7
  Top 0.305: 11.2,55.9 11.2,60.6 U$5.1 | 11.2,55.9 U$4.1 | C9.1 11.2,55.9
N$8
  Top 0.254: C8.1 9.7,53.2 9.7,50.8 10.05,50.45 U$1.2
  Top 0.305: C8.1 11.2,53.2 U$4.2
N$9
  Top 0.254: C13.1 18.69,56.96 U$6.3 17.28,56.96 16.17,55.85 16.17,54.71 15.8,54.33 15.17,54.33 13.65,52.81 U$1.44
N$10
  Top 0.254: R9.1 13.2,24.75 Q1.B
N$11
  Top 0.254: R10.1 15.8,29.35 Q2.B
N$12
  Top 0.254: U$1.45 13.15,54.2 C12.1 14.22,54.35 U$6.1
N$13  (via drill 0.35)
  Top 0.203: J1.A5 11.65,7 11.65,5.12 10.7,4.17 v10.7,3.5 | v3.39,4.24 2.74,4.24 R7.1
  Bottom 0.203: v10.7,3.5 3.6,3.5 3.39,3.71 v3.39,4.24
N$14
  Top 0.508: R1.1 16.6,13 F1.2
OUT1
  Top 0.305: U$2.DO 18.6,60.1 19.7,61.2 U$7.D1
RTS
  Top 0.254: Q2.E 15.35,25.6 R9.2 15.9,23.75 15.9,22.4 15.5,22 IC1.24
RX  (via drill 0.35)
  Top 0.254: U$1.41 15.15,52.47 15.08,52.54 v15.06,52.54 | v15.19,23 14.94,22.75 14.94,21.98 15,21.92 IC1.25
  Bottom 0.254: v15.06,52.54 4.49,52.54 1.41,49.47 1.41,6.39 2.7,5.1 5.3,5.1 6,5.8 6,6.3 8.3,8.6 10.77,8.6 12.34,7.03 12.34,4.83 12.73,4.44 13.27,4.44 13.53,4.7 13.6,4.7 13.6,4.77 13.66,4.83 13.66,5.37 13.6,5.43 13.6,5.9 13.41,6.09 13.41,8.4 12.1,9.71 11.74,9.71 10,11.45 10,18.9 11.7,20.6 14.8,20.6 15,20.8 15,23 v15.19,23
TEMP_SENS
  Top 0.254: U$21.VOUT 5.47,45.74 | C32.1 5.5,46.25 5.5,45.71 5.47,45.74 | D2.3 4.9,49 4.9,48.3 5.2,48 6,48 6.45,47.55 C32.1 | 6.5,47.3 6.5,47.25 C32.1 | 6.5,47.5 6.5,47.3 | 6.5,47.3 8.15,48.95 U$1.5 | JP1.15 2.24,43.54 2.24,45.49 2.67,45.92 5.29,45.92 5.47,45.74
TX  (via drill 0.35)
  Top 0.254: U$1.40 15.66,52.26 16.13,52.73 v16.13,53.17 | v2.39,51.38 2.13,51.38 1.41,50.66 1.41,6.39 2.7,5.1 5.3,5.1 5.98,5.78 5.98,22.02 8.75,24.79 11.8,24.79 v12.29,24.3 v12.3,24.3 | v14.5,25.7 IC1.26
  Bottom 0.254: v2.39,51.38 v2.4,51.39 4.3,53.29 16.01,53.29 v16.13,53.17 | v14.5,25.7 14.5,26 15.93,27.43 15.93,32.65 15.54,33.04 14.71,33.04 12.72,31.05 12.72,27.59 12.3,27.18 v12.3,24.3
VN  (via drill 0.35)
  Top 0.254: U$1.8 9.15,47.45 8.76,47.06 8.76,46.06 8.26,45.55 8.26,45.13 7.87,44.74 7.6,44.74 7.4,44.54 7.4,43.3 v7.5,43.2
  Bottom 0.254: v7.5,43.2 7.5,35.7 5.96,34.16 JP1.12
VUSB  (via drill 0.35)
  Top 0.254: 13.4,16.5 IC1.8 12.8,16.5 12.5,16.8 IC1.7 10.95,17.5 | U$3.EN 16,39.7 16.2,39.9 16.2,41 | U$2.VDD 17.1,59.3 17.7,59.3 17.85,59.15 17.85,58.73 C14.1 19,58.6 v19.1,58.5 20.2,58.5 20.2,58.63 | C15.1 20.2,58.63 | U$7.VDD 20.2,60 20.2,58.63
  Top 0.305: C3.1 10.95,17.5 | LED1.A 7.05,1.55 7.4,1.9 7.4,8.3 10.05,10.95 10.05,11.15
  Top 0.406: U$3.IN 16.2,41 16.95,41 C6.1
  Top 0.61: R1.2 14.85,11.05 C1.1 11.1,11.05 C2.1 10.05,11.15 9.7,11.5 9.7,14.25 C4.1 | C3.1 C4.1 | v18,41.1 17.15,41.1 C6.1 | C4.1 v11.5,14.9
  Bottom 0.305: v18,41.1 v17.99,41.11 | v19.1,58.5 19.1,57.4 17.74,56.04 17.74,43.55 17.8,43.55 18.2,43.15 18.2,42.58 17.97,42.36 17.97,42.14
  Bottom 0.406: v18,41.1 18,42.07 17.97,42.1 17.97,42.14
  Bottom 0.61: v11.5,14.9 17.64,21.04 17.64,40.74 v18,41.1

### Text on the board
tPlace: 36 | 2 | 4 | 37 | 38 | 21 | 22 | 39 | 34 | 19 | B | R | 35 | 23 | 32 | 18 | 33 | 5 | 25 | 17 | 26 | 16 | 27 | 14 | GND | 12 | 13 | 3.3v | 5v | 15